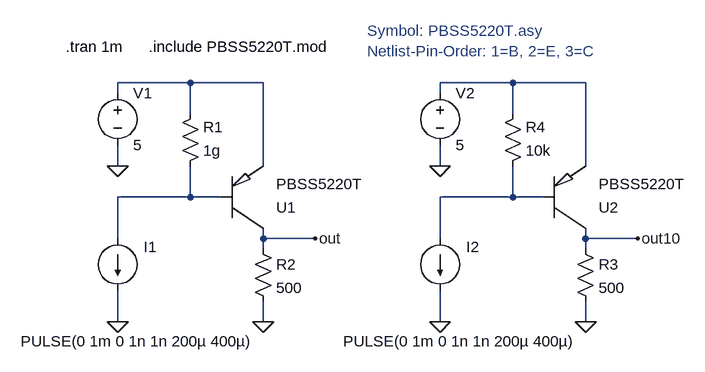
[diagram p0: schematic PNP-PBSS5220_switch.asc]
PNP-PBSS5220_switch.asc, the LTspice schematic file:
Version 4
SHEET 1 940 680
WIRE 144 0 32 0
WIRE 256 0 144 0
WIRE 640 0 528 0
WIRE 752 0 640 0
WIRE 32 16 32 0
WIRE 528 16 528 0
WIRE 144 48 144 0
WIRE 640 48 640 0
WIRE 32 128 32 96
WIRE 256 128 256 0
WIRE 528 128 528 96
WIRE 752 128 752 0
WIRE 144 176 144 128
WIRE 144 176 32 176
WIRE 192 176 144 176
WIRE 640 176 640 128
WIRE 640 176 528 176
WIRE 688 176 640 176
WIRE 32 240 32 176
WIRE 256 240 256 224
WIRE 336 240 256 240
WIRE 528 240 528 176
WIRE 752 240 752 224
WIRE 832 240 752 240
WIRE 256 256 256 240
WIRE 752 256 752 240
WIRE 32 368 32 320
WIRE 256 368 256 336
WIRE 528 368 528 320
WIRE 752 368 752 336
FLAG 32 128 0
FLAG 256 368 0
FLAG 32 368 0
FLAG 336 240 out
FLAG 528 128 0
FLAG 752 368 0
FLAG 528 368 0
FLAG 832 240 out10
SYMBOL res 240 240 R0
SYMATTR InstName R2
SYMATTR Value 500
SYMBOL voltage 32 0 R0
SYMATTR InstName V1
SYMATTR Value 5
SYMBOL res 128 144 M180
WINDOW 0 36 76 Left 0
WINDOW 3 36 40 Left 0
SYMATTR InstName R1
SYMATTR Value 1g
SYMBOL current 32 240 R0
WINDOW 0 40 13 Left 0
WINDOW 3 -149 158 Left 0
WINDOW 39 0 0 Left 0
SYMATTR InstName I1
SYMATTR Value PULSE(0 1m 0 1n 1n 200µ 400µ)
SYMATTR Value2 AC 100m 0
SYMBOL PBSS5220T 192 224 M180
SYMATTR InstName U1
SYMBOL res 736 240 R0
SYMATTR InstName R3
SYMATTR Value 500
SYMBOL voltage 528 0 R0
SYMATTR InstName V2
SYMATTR Value 5
SYMBOL res 624 144 M180
WINDOW 0 36 76 Left 0
WINDOW 3 36 40 Left 0
SYMATTR InstName R4
SYMATTR Value 10k
SYMBOL current 528 240 R0
WINDOW 0 40 13 Left 0
WINDOW 3 -149 158 Left 0
WINDOW 39 0 0 Left 0
SYMATTR InstName I2
SYMATTR Value PULSE(0 1m 0 1n 1n 200µ 400µ)
SYMATTR Value2 AC 100m 0
SYMBOL PBSS5220T 688 224 M180
SYMATTR InstName U2
TEXT -48 -56 Left 0 !.tran 1m
TEXT 80 -56 Left 0 !.include PBSS5220T.mod
TEXT 416 -80 Left 0 ;Symbol: PBSS5220T.asy\nNetlist-Pin-Order: 1=B, 2=E, 3=C

The netlist it stands for:
* PNP-PBSS5220_switch.asc
R2 out 0 500
V1 N001 0 5
R1 N003 N001 1g
I1 N003 0 PULSE(0 1m 0 1n 1n 200µ 400µ) AC 100m 0
XU1 N003 N001 out PBSS5220T  ; pins B E C
R3 out10 0 500
V2 N002 0 5
R4 N004 N002 10k
I2 N004 0 PULSE(0 1m 0 1n 1n 200µ 400µ) AC 100m 0
XU2 N004 N002 out10 PBSS5220T  ; pins B E C
.tran 1m
.include PBSS5220T.mod
* Symbol: PBSS5220T.asy
* Netlist-Pin-Order: 1=B, 2=E, 3=C
.backanno
.end